# Altium project dianfazhan.PRJPCB
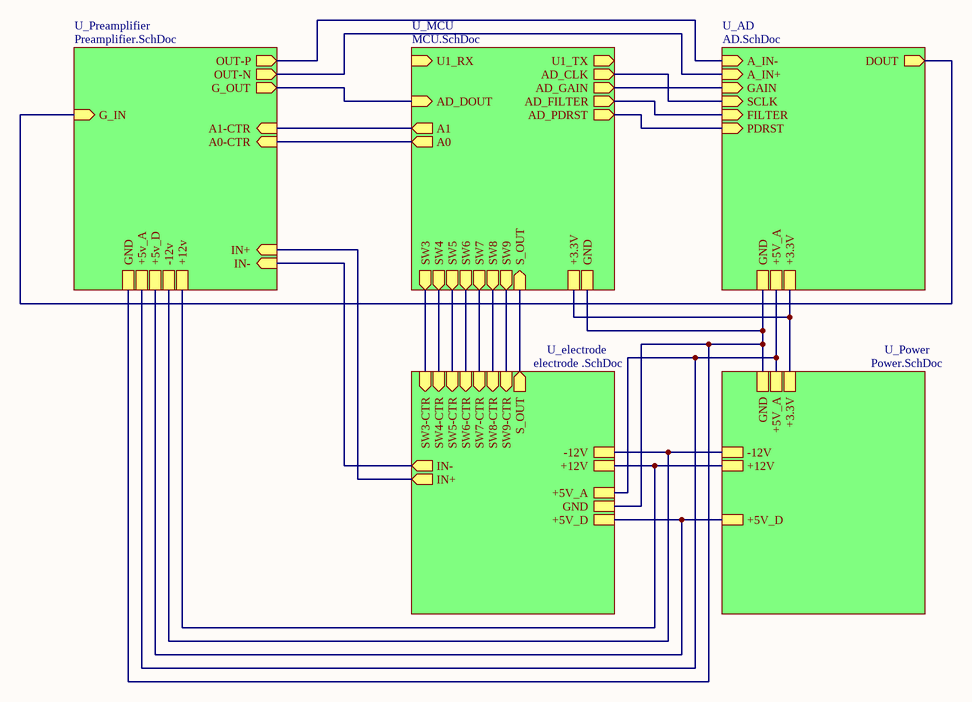
[diagram p0: main.SchDoc]
7 sheets, 227 parts. Net scope: hierarchical (ports join the sheet entries above them; power ports are global).
Sheets:
  main.SchDoc
    U_MCU = MCU.SchDoc
    U_AD = AD.SchDoc
    U_Power = Power.SchDoc
  GPS.SchDoc
  Preamplifier_2.SchDoc
  electrode 2.SchDoc

## Sheet main.SchDoc
size A4

### Sub-sheets
U_AD = AD.SchDoc: A_IN- (in), A_IN+ (in), PDRST (in), FILTER (in), SCLK (in), DOUT (out), GAIN (in), +3.3V, +5V_A, GND
U_electrode = electrode .SchDoc (file not in this document): SW3-CTR (in), SW4-CTR (in), SW5-CTR (in), SW6-CTR (in), SW7-CTR (in), SW8-CTR (in), SW9-CTR (in), IN+ (out), IN- (out), +12V, GND, +5V_A, S_OUT (out), -12V, +5V_D
U_MCU = MCU.SchDoc: U1_RX (in), U1_TX (out), +3.3V, GND, AD_CLK (out), AD_DOUT (in), AD_GAIN (out), AD_FILTER (out), AD_PDRST (out), S_OUT (in), SW3 (out), SW4 (out), SW5 (out), SW6 (out), SW7 (out), SW8 (out), SW9 (out), A1 (out), A0 (out)
U_Power = Power.SchDoc: +12V, -12V, +5V_A, +3.3V, GND, +5V_D
U_Preamplifier = Preamplifier.SchDoc (file not in this document): IN+ (in), IN- (in), A0-CTR (in), A1-CTR (in), OUT-P (out), OUT-N (out), G_IN (in), G_OUT (out), +12v, -12v, +5v_D, GND, +5v_A

### Nets
+3.3V: sheet U_MCU/+3.3V, sheet U_AD/+3.3V, sheet U_Power/+3.3V
+5V_A: sheet U_AD/+5V_A, sheet U_Power/+5V_A, sheet U_Preamplifier/+5v_A, sheet U_electrode/+5V_A
+5V_D: sheet U_Power/+5V_D, sheet U_Preamplifier/+5v_D, sheet U_electrode/+5V_D
+12V: sheet U_Power/+12V, sheet U_Preamplifier/+12v, sheet U_electrode/+12V
-12V: sheet U_Power/-12V, sheet U_Preamplifier/-12v, sheet U_electrode/-12V
A_IN+: sheet U_AD/A_IN+, sheet U_Preamplifier/OUT-N
A_IN-: sheet U_AD/A_IN-, sheet U_Preamplifier/OUT-P
DOUT: sheet U_AD/DOUT, sheet U_Preamplifier/G_IN
FILTER: sheet U_MCU/AD_FILTER, sheet U_AD/FILTER
GAIN: sheet U_MCU/AD_GAIN, sheet U_AD/GAIN
PDRST: sheet U_MCU/AD_PDRST, sheet U_AD/PDRST
SCLK: sheet U_MCU/AD_CLK, sheet U_AD/SCLK
NetR26_2: sheet U_MCU/GND, sheet U_AD/GND, sheet U_Power/GND, sheet U_Preamplifier/GND, sheet U_electrode/GND
NetU36_8: sheet U_MCU/S_OUT, sheet U_electrode/S_OUT
NetU36_9: sheet U_MCU/SW3, sheet U_electrode/SW3-CTR
NetU36_10: sheet U_MCU/SW4, sheet U_electrode/SW4-CTR
NetU36_11: sheet U_MCU/SW5, sheet U_electrode/SW5-CTR
NetU36_14: sheet U_MCU/SW6, sheet U_electrode/SW6-CTR
NetU36_15: sheet U_MCU/SW7, sheet U_electrode/SW7-CTR
NetU36_16: sheet U_MCU/SW8, sheet U_electrode/SW8-CTR
NetU36_17: sheet U_MCU/SW9, sheet U_electrode/SW9-CTR
NetU36_22: sheet U_MCU/AD_DOUT, sheet U_Preamplifier/G_OUT
NetU36_58: sheet U_MCU/A1, sheet U_Preamplifier/A1-CTR
NetU36_59: sheet U_MCU/A0, sheet U_Preamplifier/A0-CTR
(unnamed): sheet U_Preamplifier/IN+, sheet U_electrode/IN+
(unnamed): sheet U_Preamplifier/IN-, sheet U_electrode/IN-

## Sheet MCU.SchDoc
size A4
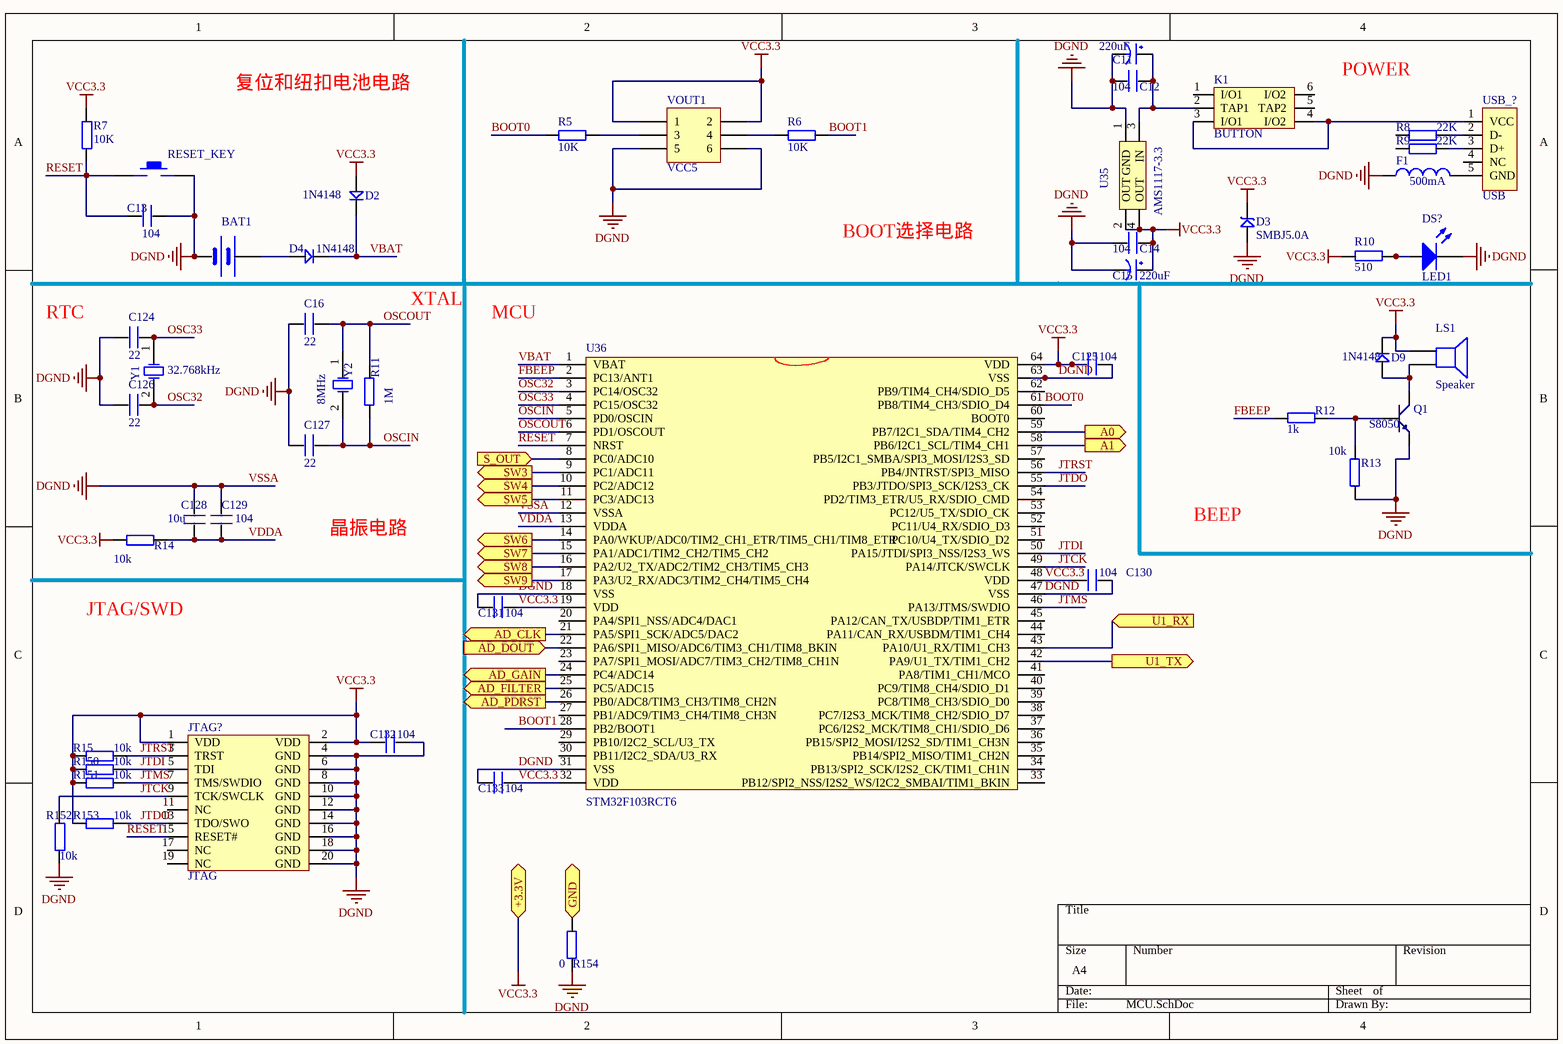
[diagram p1: MCU.SchDoc]

### Parts
BAT1  BATT  [BATM]  (value not drawn)
C11  220uF  [CC6.56.5]
C12  104  [0603P]
C13  104  [0603P]
C14  104  [0603P]
C15  220uF  [CC6.56.5]
C16  22  [0603P]
C124  22  [0603P]
C125  104  [0603P]
C126  22  [0603P]
C127  22  [0603P]
C128  10u  [0603P]
C129  104  [0603P]
C130  104  [0603P]
C131  104  [0603P]
C132  104  [0603P]
C133  104  [0603P]
D2  1N4148  [DIODE_SOP]
D3  SMBJ5.0A  [SMBJ]
D4  1N4148  [DIODE_SOP]
D9  1N4148  [DIODE_SOP]
DS?  LED1  [SMDLED]
F1  value 500mA  [0402-A]  (hidden comment: Inductor)
JTAG?  JTAG  [JTAG_20]
K1  BUTTON  [BTN8.5*8.5]
LS1  Speaker  [PIN2]
Q1  S8050  [SOT-23R]
R5  10K  [0603P]
R6  10K  [0603P]
R7  10K  [0603P]
R8  22K  [0603P]
R9  22K  [0603P]
R10  510  [0603P]
R11  1M  [0603P]
R12  1k  [0603P]
R13  10k  [0603P]
R14  10k  [0603P]
R15  10k  [0603P]
R150  10k  [0603P]
R151  10k  [0603P]
R152  10k  [0603P]
R153  10k  [0603P]
R154  0  [0603P]
RESET_KEY  KEY_M  [KEY_M]  (value not drawn)
U35  AMS1117-3.3  [AMS1117]
U36  STM32F103RCT6  [LQFP64]
USB_?  USB  [USB/SM0.8-6H5]
VOUT1  VCC5  [HDR2X3]
Y1  32.768kHz  [XTAL_US]
Y2  8MHz  [XTAL_US]

### Ports
+3.3V, A0 (out), A1 (out), AD_CLK (out), AD_DOUT (in), AD_FILTER (out), AD_GAIN (out), AD_PDRST (out), GND, S_OUT (in), SW3 (out), SW4 (out), SW5 (out), SW6 (out), SW7 (out), SW8 (out), SW9 (out), U1_RX (in), U1_TX (out)

### Nets
DGND: BAT1.2(GND) C11.2(GND) C12.2 C13.2 C14.2 C15.2(GND) C16.1 C124.1 C125.2 C126.1 C127.2 C128.2 C129.2 C130.2 C131.1 C132.2 C133.1 D3.1 DS?.2(K) F1.1 JTAG?.4(GND) JTAG?.6(GND) JTAG?.8(GND) JTAG?.10(GND) JTAG?.12(GND) JTAG?.14(GND) JTAG?.16(GND) JTAG?.18(GND) JTAG?.20(GND) Q1.1(E) R13.2 R152.1 R154.2 RESET_KEY.2 U35.1(GND) U36.12(VSSA) U36.18(VSS) U36.31(VSS) U36.47(VSS) U36.63(VSS) VOUT1.5 VOUT1.6  [also labelled VSSA]
VCC3.3: C14.1 C15.1(VCC) C125.1 C130.1 C131.2 C132.1 C133.2 D2.1 D3.2 D9.2 JTAG?.1(VDD) JTAG?.2(VDD) LS1.1 R7.2 R10.2 R14.1 R15.1 R150.1 R151.1 R153.1 U35.2(OUT) U35.4(OUT) U36.19(VDD) U36.32(VDD) U36.48(VDD) U36.64(VDD) VOUT1.1 VOUT1.2 ; port +3.3V  [project net +3.3V]
BOOT0: R5.1 U36.61(PB8/TIM4_CH3/SDIO_D4)
BOOT1: R6.2 U36.28(PB2/BOOT1)
FBEEP: R12.2 U36.2(PC13/ANT1)
FILTER: U36.25(PC5/ADC15) ; port AD_FILTER
GAIN: U36.24(PC4/ADC14) ; port AD_GAIN
JTCK: JTAG?.9(TCK/SWCLK) R152.2 U36.49(PA14/JTCK/SWCLK)
JTDI: JTAG?.5(TDI) R150.2 U36.50(PA15/JTDI/SPI3_NSS/I2S3_WS)
JTDO: JTAG?.13(TDO/SWO) R153.2 U36.55(PB3/JTDO/SPI3_SCK/I2S3_CK)
JTMS: JTAG?.7(TMS/SWDIO) R151.2 U36.46(PA13/JTMS/SWDIO)
JTRST: JTAG?.3(TRST) R15.2 U36.56(PB4/JNTRST/SPI3_MISO)
OSC32: C126.2 U36.3(PC14/OSC32) Y1.2(OSC2)
OSC33: C124.2 U36.4(PC15/OSC32) Y1.1(OSC1)
OSCIN: C127.1 R11.2 U36.5(PD0/OSCIN) Y2.2(OSC2)
OSCOUT: C16.2 R11.1 U36.6(PD1/OSCOUT) Y2.1(OSC1)
PDRST: U36.26(PB0/ADC8/TIM3_CH3/TIM8_CH2N) ; port AD_PDRST
RESET: C13.1 JTAG?.15(RESET#) R7.1 RESET_KEY.1 U36.7(NRST)
SCLK: U36.21(PA5/SPI1_SCK/ADC5/DAC2) ; port AD_CLK
VBAT: D2.2 D4.2 U36.1(VBAT)
VDDA: C128.1 C129.1 R14.2 U36.13(VDDA)
NetBAT1_1: BAT1.1(VCC) D4.1
NetC11_1: C11.1(VCC) C12.1 K1.2(TAP1) U35.3(IN)
NetD9_1: D9.1 LS1.2 Q1.3(C)
NetDS?_1: DS?.1(A) R10.1
NetF1_2: F1.2 USB_?.5(GND)
NetK1_3: K1.3(I/O1) K1.4(I/O2) USB_?.1(VCC)
NetQ1_2: Q1.2(B) R12.1 R13.1
NetR5_2: R5.2 VOUT1.3
NetR6_1: R6.1 VOUT1.4
NetR8_2: R8.2 USB_?.2(D-)
NetR9_2: R9.2 USB_?.3(D+)
NetR26_2: R154.1 ; port GND
NetU36_8: U36.8(PC0/ADC10) ; port S_OUT
NetU36_9: U36.9(PC1/ADC11) ; port SW3
NetU36_10: U36.10(PC2/ADC12) ; port SW4
NetU36_11: U36.11(PC3/ADC13) ; port SW5
NetU36_14: U36.14(PA0/WKUP/ADC0/TIM2_CH1_ETR/TIM5_CH1/TIM8_ETR) ; port SW6
NetU36_15: U36.15(PA1/ADC1/TIM2_CH2/TIM5_CH2) ; port SW7
NetU36_16: U36.16(PA2/U2_TX/ADC2/TIM2_CH3/TIM5_CH3) ; port SW8
NetU36_17: U36.17(PA3/U2_RX/ADC3/TIM2_CH4/TIM5_CH4) ; port SW9
NetU36_22: U36.22(PA6/SPI1_MISO/ADC6/TIM3_CH1/TIM8_BKIN) ; port AD_DOUT
NetU36_42: U36.42(PA9/U1_TX/TIM1_CH2) ; port U1_TX
NetU36_43: U36.43(PA10/U1_RX/TIM1_CH3) ; port U1_RX
NetU36_58: U36.58(PB6/I2C1_SCL/TIM4_CH1) ; port A1
NetU36_59: U36.59(PB7/I2C1_SDA/TIM4_CH2) ; port A0

Not connected (* = marked no-connect by the designer): JTAG? 11(NC) 17(NC) 19(NC); K1 1(I/O1) 5(TAP2) 6(I/O2); R8 1; R9 1; U36 20(PA4/SPI1_NSS/ADC4/DAC1) 23(PA7/SPI1_MOSI/ADC7/TIM3_CH2/TIM8_CH1N) 27(PB1/ADC9/TIM3_CH4/TIM8_CH3N) 29(PB10/I2C2_SCL/U3_TX) 30(PB11/I2C2_SDA/U3_RX) 33(PB12/SPI2_NSS/I2S2_WS/I2C2_SMBAI/TIM1_BKIN) 34(PB13/SPI2_SCK/I2S2_CK/TIM1_CH1N) 35(PB14/SPI2_MISO/TIM1_CH2N) 36(PB15/SPI2_MOSI/I2S2_SD/TIM1_CH3N) 37(PC6/I2S2_MCK/TIM8_CH1/SDIO_D6) 38(PC7/I2S3_MCK/TIM8_CH2/SDIO_D7) 39(PC8/TIM8_CH3/SDIO_D0) 40(PC9/TIM8_CH4/SDIO_D1) 41(PA8/TIM1_CH1/MCO) 44(PA11/CAN_RX/USBDM/TIM1_CH4) 45(PA12/CAN_TX/USBDP/TIM1_ETR) 51(PC10/U4_TX/SDIO_D2) 52(PC11/U4_RX/SDIO_D3) 53(PC12/U5_TX/SDIO_CK) 54(PD2/TIM3_ETR/U5_RX/SDIO_CMD) 57(PB5/I2C1_SMBA/SPI3_MOSI/I2S3_SD) 60(BOOT0) 62(PB9/TIM4_CH4/SDIO_D5); USB_? 4(NC)

### Notes on the sheet
- 复位和纽扣电池电路
- POWER
- BOOT选择电路
- RTC
- XTAL
- MCU
- BEEP
- 晶振电路
- JTAG/SWD

### Library data of the parts
BAT1 = BAT
C11 C15 = CAP
C12-C14 C16 C124-C133 = C
D2 D4 D9 = D
D3 = SMBJ: TVS
DS? = LED2: Typical RED, GREEN, YELLOW, AMBER GaAs LED; Published: 8-Jun-2000; LatestRevisionDate: 17-Jul-2002; LatestRevisionNote: Re-released for DXP Platform.; PackageDocument: Feb-2002; PackageReference: 3.2X1.6X1.1; Publisher: Altium Limited
F1 = Inductor: Code_IEC: 1005; Published: 8-Jun-2000; LatestRevisionDate: 17-Jul-2002; LatestRevisionNote: Re-released for DXP Platform.; PackageReference: 0402-A; Publisher: Altium Limited; Code_JEITA: 0402
LS1 = Speaker: Loudspeaker; Published: 24-Mar-1999; LatestRevisionDate: 17-Jul-2002; LatestRevisionNote: Re-released for DXP Platform.; PackageReference: PIN2; Publisher: Altium Limited
Q1 = NPN: 8050/BCW846/BCW847
R5-R15 R150-R154 = R
U35 = AMS1117
U36 = STM32F103RDT6
USB_? = USB5
VOUT1 = Header 3X2: Header, 3-Pin, Dual row; LatestRevisionDate: 17-Jul-2002; LatestRevisionNote: Re-released for DXP Platform.; Publisher: Altium Limited
Y1 Y2 = XTAL: Crystal Oscillator; Published: 8-Jun-2000; LatestRevisionDate: 17-Jul-2002; LatestRevisionNote: Re-released for DXP Platform.; Publisher: Altium Limited

## Sheet AD.SchDoc
size 203 x 152 mm
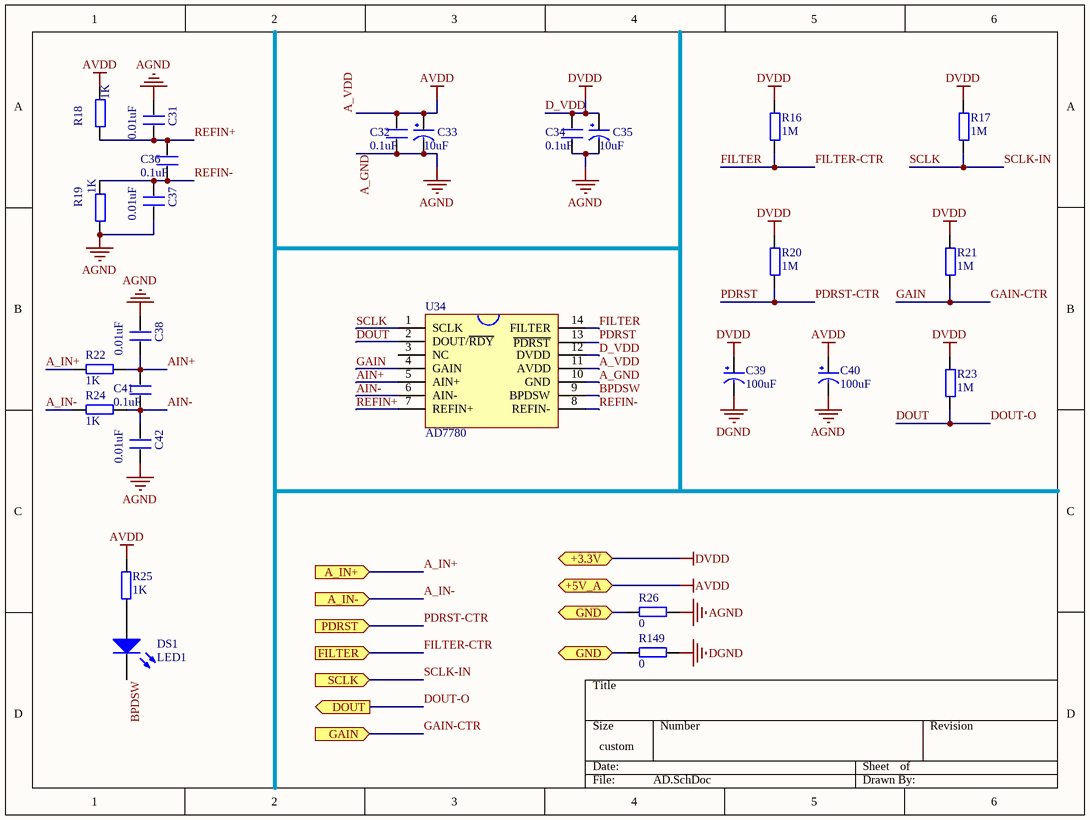
[diagram p2: AD.SchDoc]

### Parts
C31  0.01uF  [0603P]
C32  0.1uF  [0603P]
C33  10uF  [CC6.56.5]
C34  0.1uF  [0603P]
C35  10uF  [CC6.56.5]
C36  0.1uF  [0603P]
C37  0.01uF  [0603P]
C38  0.01uF  [0603P]
C39  100uF  [CC6.56.5]
C40  100uF  [CC6.56.5]
C41  0.1uF  [0603P]
C42  0.01uF  [0603P]
DS1  LED1  [SMDLED]
R16  1M  [0603P]
R17  1M  [0603P]
R18  1K  [0603P]
R19  1K  [0603P]
R20  1M  [0603P]
R21  1M  [0603P]
R22  1K  [0603P]
R23  1M  [0603P]
R24  1K  [0603P]
R25  1K  [0603P]
R26  0  [0603P]
R149  0  [0603P]
U34  AD7780  [SOIC_14]

### Ports
+3.3V, +5V_A, A_IN+ (in), A_IN- (in), DOUT (out), FILTER (in), GAIN (in), GND, PDRST (in), SCLK (in)

### Nets
A_GND: C31.2 C32.1 C33.2(GND) C34.1 C35.2(GND) C37.1 C38.2 C40.2(GND) C42.1 R19.1 R26.1 U34.10(GND)  [also labelled AGND]
A_VDD: C32.2 C33.1(VCC) C40.1(VCC) R18.2 R25.1 U34.11(AVDD) ; port +5V_A  [also labelled AVDD]  [project net +5V_A]
D_VDD: C34.2 C35.1(VCC) C39.1(VCC) R16.2 R17.2 R20.2 R21.2 R23.2 U34.12(DVDD) ; port +3.3V  [also labelled DVDD]  [project net +3.3V]
DGND: C39.2(GND) R149.1
A_IN+: R22.2 ; port A_IN+
A_IN-: R24.2 ; port A_IN-
AIN+: C38.1 C41.2 R22.1 U34.5(AIN+)
AIN-: C41.1 C42.2 R24.1 U34.6(AIN-)
BPDSW: DS1.2(K) U34.9(BPDSW)
DOUT: R23.1 U34.2(DOUT/~{RDY}) ; port DOUT  [also labelled DOUT-O]
FILTER: R16.1 U34.14(FILTER) ; port FILTER  [also labelled FILTER-CTR]
GAIN: R21.1 U34.4(GAIN) ; port GAIN  [also labelled GAIN-CTR]
PDRST: R20.1 U34.13(~{PDRST}) ; port PDRST  [also labelled PDRST-CTR]
REFIN+: C31.1 C36.2 R18.1 U34.7(REFIN+)
REFIN-: C36.1 C37.2 R19.2 U34.8(REFIN-)
SCLK: R17.1 U34.1(SCLK) ; port SCLK  [also labelled SCLK-IN]
NetDS1_1: DS1.1(A) R25.2
NetR26_2: R26.2 R149.2 ; port GND

Not connected (* = marked no-connect by the designer): U34 3(NC)

### Library data of the parts
C31 C32 C34 C36-C38 C41 C42 = C
C33 C35 C39 C40 = CAP
DS1 = LED2: as DS? on sheet MCU; Published: 8-Jun-2000; LatestRevisionDate: 17-Jul-2002; LatestRevisionNote: Re-released for DXP Platform.; PackageDocument: Feb-2002; PackageReference: 3.2X1.6X1.1; Publisher: Altium Limited
R16-R26 R149 = R

## Sheet Power.SchDoc
size 241 x 215 mm
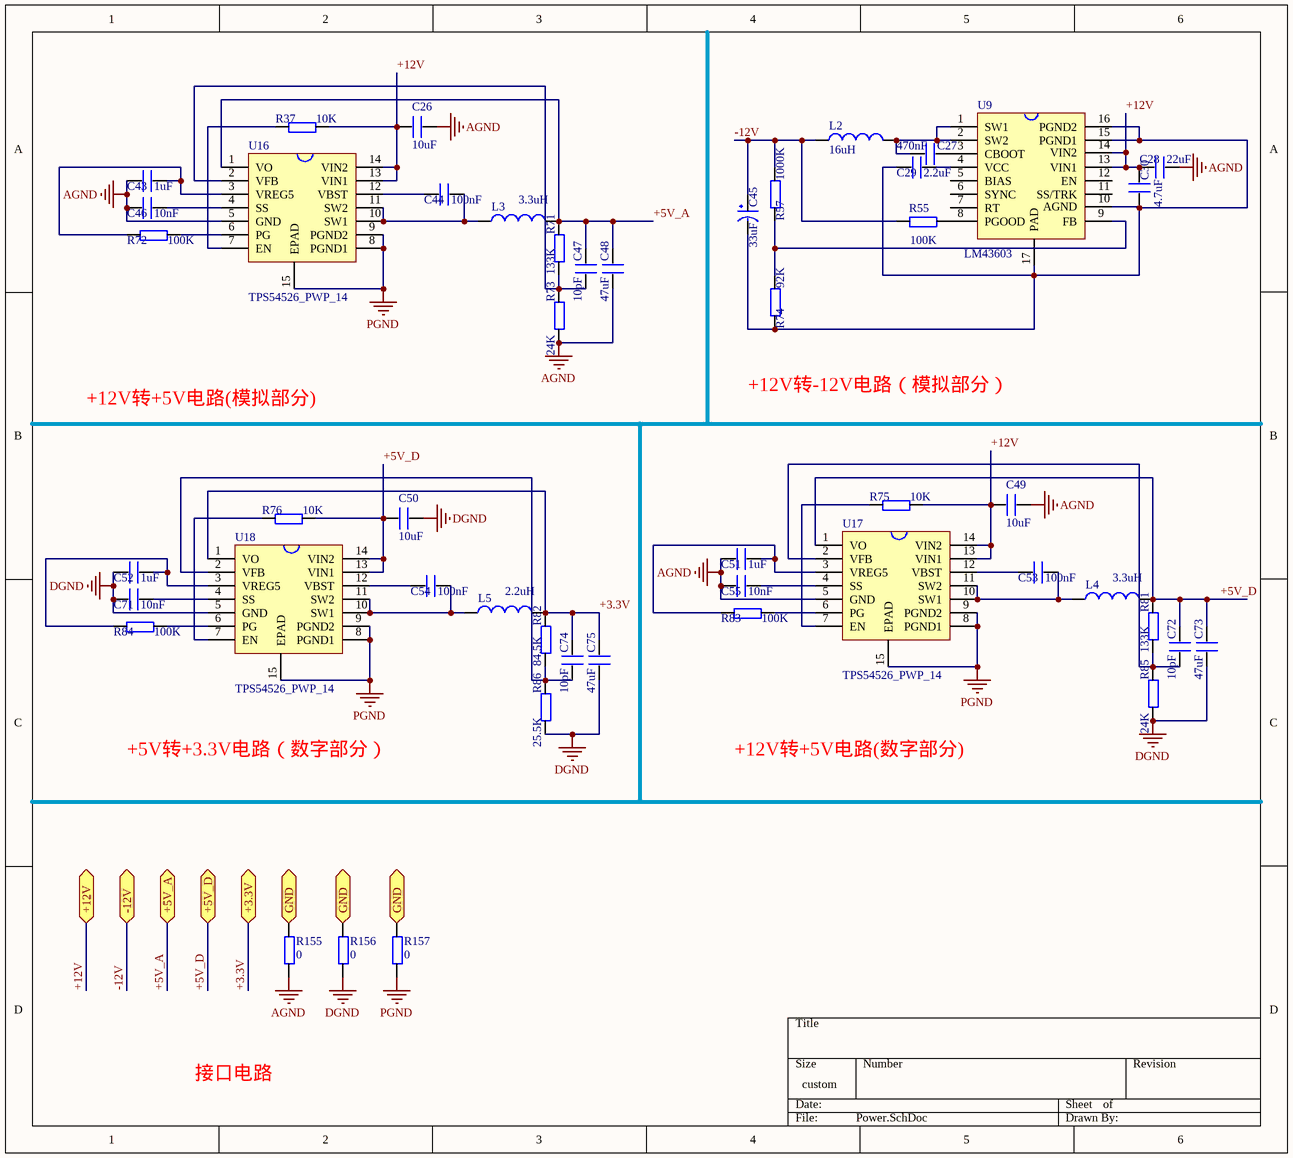
[diagram p3: Power.SchDoc]

### Parts
C26  10uF  [0603P]
C27  470nF  [0603P]
C28  22uF  [0603P]
C29  2.2uF  [0603P]
C30  4.7uF  [0603P]
C43  1uF  [0603P]
C44  100nF  [0603P]
C45  33uF  [CC6.56.5]
C46  10nF  [0603P]
C47  10pF  [0603P]
C48  47uF  [0603P]
C49  10uF  [0603P]
C50  10uF  [0603P]
C51  1uF  [0603P]
C52  1uF  [0603P]
C53  100nF  [0603P]
C54  100nF  [0603P]
C55  10nF  [0603P]
C71  10nF  [0603P]
C72  10pF  [0603P]
C73  47uF  [0603P]
C74  10pF  [0603P]
C75  47uF  [0603P]
L2  value 16uH  [0402-A]  (hidden comment: Inductor)
L3  value 3.3uH  [0402-A]  (hidden comment: Inductor)
L4  value 3.3uH  [0402-A]  (hidden comment: Inductor)
L5  value 2.2uH  [0402-A]  (hidden comment: Inductor)
R37  10K  [0603P]
R55  100K  [0603P]
R57  1000K  [0603P]
R71  133K  [0603P]
R72  100K  [0603P]
R73  24K  [0603P]
R74  92K  [0603P]
R75  10K  [0603P]
R76  10K  [0603P]
R81  133K  [0603P]
R82  84.5K  [0603P]
R83  100K  [0603P]
R84  100K  [0603P]
R85  24K  [0603P]
R86  25.5K  [0603P]
R155  0  [0603P]
R156  0  [0603P]
R157  0  [0603P]
U9  LM43603
U16  TPS54526_PWP_14  [HTSSOP]
U17  TPS54526_PWP_14  [HTSSOP]
U18  TPS54526_PWP_14  [HTSSOP]

### Ports
+3.3V, +5V_A, +5V_D, +12V, -12V, GND

### Nets
+3.3V: C74.2 C75.2 L5.2 R82.2 U18.1(VO) ; port +3.3V
+5V_A: C47.2 C48.2 L3.2 R71.2 U16.1(VO) ; port +5V_A
AGND: C26.2 C28.2 C43.1 C46.1 C48.1 C49.2 C51.1 C55.1 R73.1 R155.1 U16.5(GND) U17.5(GND)  [project net A_GND]
DGND: C50.2 C52.1 C71.1 C73.1 C75.1 R85.1 R86.1 R156.1 U18.5(GND)
PGND: R157.1 U16.8(PGND1) U16.9(PGND2) U16.15(EPAD) U17.8(PGND1) U17.9(PGND2) U17.15(EPAD) U18.8(PGND1) U18.9(PGND2) U18.15(EPAD)
+5V_D: C50.1 C72.2 C73.2 L4.2 R76.2 R81.2 U17.1(VO) U18.13(VIN1) U18.14(VIN2) ; port +5V_D
+12V: C26.1 C28.1 C30.2 C49.1 R37.2 R75.2 U9.13(VIN1) U9.14(VIN2) U16.13(VIN1) U16.14(VIN2) U17.13(VIN1) U17.14(VIN2) ; port +12V
-12V: C45.1(VCC) L2.1 R55.1 R57.2 ; port -12V
NetC27_1: C27.1 L2.2 U9.1(SW1) U9.2(SW2)
NetC27_2: C27.2 U9.3(CBOOT)
NetC29_1: C29.1 C30.1 C45.2(GND) R74.1 U9.10(AGND) U9.15(PGND1) U9.16(PGND2) U9.17(PAD)
NetC29_2: C29.2 U9.4(VCC)
NetC43_2: C43.2 R72.1 U16.3(VREG5)
NetC44_1: C44.1 U16.12(VBST)
NetC44_2: C44.2 L3.1 U16.10(SW1) U16.11(SW2)
NetC46_2: C46.2 U16.4(SS)
NetC47_1: C47.1 R71.1 R73.2 U16.2(VFB)
NetC51_2: C51.2 R83.1 U17.3(VREG5)
NetC52_2: C52.2 R84.1 U18.3(VREG5)
NetC53_1: C53.1 U17.12(VBST)
NetC53_2: C53.2 L4.1 U17.10(SW1) U17.11(SW2)
NetC54_1: C54.1 U18.12(VBST)
NetC54_2: C54.2 L5.1 U18.10(SW1) U18.11(SW2)
NetC55_2: C55.2 U17.4(SS)
NetC71_2: C71.2 U18.4(SS)
NetC72_1: C72.1 R81.1 R85.2 U17.2(VFB)
NetC74_1: C74.1 R82.1 R86.2 U18.2(VFB)
NetR26_2: R155.2 R156.2 R157.2 ; port GND
NetR37_1: R37.1 U16.7(EN)
NetR55_2: R55.2 U9.8(PGOOD)
NetR57_1: R57.1 R74.2 U9.9(FB)
NetR72_2: R72.2 U16.6(PG)
NetR75_1: R75.1 U17.7(EN)
NetR76_1: R76.1 U18.7(EN)
NetR83_2: R83.2 U17.6(PG)
NetR84_2: R84.2 U18.6(PG)

Not connected (* = marked no-connect by the designer): U9 5(BIAS) 6(SYNC) 7(RT) 11(SS/TRK) 12(EN)

### Notes on the sheet
- +12V转+5V电路(模拟部分)
- +12V转-12V电路（模拟部分）
- +5V转+3.3V电路（数字部分）
- +12V转+5V电路(数字部分)
- 接口电路

### Library data of the parts
C26-C30 C43 C44 C46-C55 C71-C75 = C
C45 = CAP
L2-L5 = Inductor: Code_IEC: 1005; Published: 8-Jun-2000; LatestRevisionDate: 29-May-2009; LatestRevisionNote: IPC-7351 Footprint Added.; PackageReference: 0402-A; Publisher: Altium Limited; PackageDescription: Chip Inductor; Code_JEITA: 0402
R37 R55 R57 R71-R76 R81-R86 R155-R157 = R
U16-U18 = TPS54526

## Sheet GPS.SchDoc
size A4
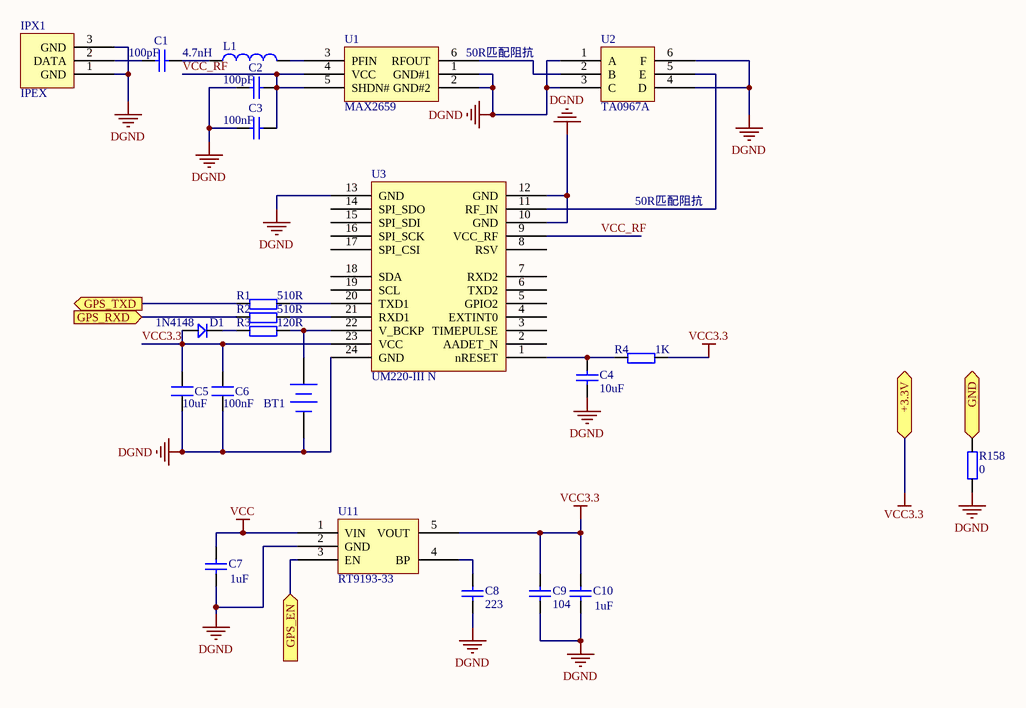
[diagram p4: GPS.SchDoc]

### Parts
BT1  Battery  [BAT]  (value not drawn)
C1  value 100pF  [0805]  (hidden comment: Cap)
C2  value 100pF  [0805]  (hidden comment: Cap)
C3  value 100nF  [0805]  (hidden comment: Cap)
C4  value 10uF  [0805]  (hidden comment: Cap)
C5  10uF  [0805]
C6  100nF  [0805]
C7  value 1uF  [0805]  (hidden comment: Cap)
C8  value 223  [0805]  (hidden comment: Cap)
C9  value 104  [0805]  (hidden comment: Cap)
C10  value 1uF  [0805]  (hidden comment: Cap)
D1  1N4148  [LC-SOD-323]
IPX1  IPEX  [IPEX]
L1  value 4.7nH  [0805]  (hidden comment: Inductor)
R1  510R  [0805]
R2  510R  [0805]
R3  120R  [0805]
R4  1K  [0805]
R158  0  [0805]
U1  MAX2659  [LC-uDFN-6]
U2  TA0967A  [TA0967A]
U3  UM220-III N  [UM220-III N]
U11  RT9193-33  [RT9193-33]

### Ports
+3.3V, GND, GPS_EN (in), GPS_RXD (in), GPS_TXD (out)

### Nets
DGND: BT1.2(-) C2.1 C3.1 C4.1 C5.1 C6.1 C7.1 C8.1 C9.1 C10.1 IPX1.1(GND) IPX1.3(GND) R158.1 U1.1(GND#1) U1.2(GND#2) U2.1(A) U2.3(C) U2.4(D) U2.6(F) U3.10(GND) U3.12(GND) U3.13(GND) U3.24(GND) U11.2(GND)
VCC: C7.2 U11.1(VIN)
VCC3.3: C5.2 C6.2 C9.2 C10.2 D1.1 R4.2 U3.23(VCC) U11.5(VOUT) ; port +3.3V  [project net +3.3V]
VCC_RF: C2.2 C3.2 U1.4(VCC) U1.5(SHDN#) U3.9(VCC_RF)
NetBT1_1: BT1.1(+) R3.2 U3.22(V_BCKP)
NetC1_1: C1.1 IPX1.2(DATA)
NetC1_2: C1.2 L1.1
NetC4_2: C4.2 R4.1 U3.1(nRESET)
NetC8_2: C8.2 U11.4(BP)
NetD1_2: D1.2 R3.1
NetL1_2: L1.2 U1.3(PFIN)
NetR1_1: R1.1 ; port GPS_TXD
NetR1_2: R1.2 U3.20(TXD1)
NetR2_1: R2.1 ; port GPS_RXD
NetR2_2: R2.2 U3.21(RXD1)
NetR158_2: R158.2 ; port GND
NetU1_6: U1.6(RFOUT) U2.2(B)
NetU2_5: U2.5(E) U3.11(RF_IN)
NetU11_3: U11.3(EN) ; port GPS_EN

Not connected (* = marked no-connect by the designer): U3 2(AADET_N) 3(TIMEPULSE) 4(EXTINT0) 5(GPIO2) 6(TXD2) 7(RXD2) 8(RSV) 14(SPI_SDO) 15(SPI_SDI) 16(SPI_SCK) 17(SPI_CSI) 18(SDA) 19(SCL)

### Notes on the sheet
- (near U1) 50R匹配阻抗
- 50R匹配阻抗

### Library data of the parts
BT1 = Battery: Multicell Battery; Published: 24-Mar-1999; LatestRevisionDate: 17-Jul-2002; LatestRevisionNote: Re-released for DXP Platform.; PackageReference: BAT-2; Publisher: Altium Limited; PackageDescription: Battery; 2 Leads
C1-C4 C7-C10 = Cap: Capacitor; Published: 8-Jun-2000; LatestRevisionDate: 17-Jul-2002; LatestRevisionNote: Re-released for DXP Platform.; PackageReference: RAD-0.3; Publisher: Altium Limited; PackageDescription: Radial Cap, Thru-Hole; 2 Leads; 0.3 in Pin Spacing
C5 C6 = C
D1 = D
IPX1 = IPX
L1 = Inductor: Code_IEC: 1005; Published: 8-Jun-2000; LatestRevisionDate: 29-May-2009; LatestRevisionNote: IPC-7351 Footprint Added.; PackageReference: 0402-A; Publisher: Altium Limited; PackageDescription: Chip Inductor; Code_JEITA: 0402
R1-R4 R158 = R
U3 = Component_1

## Sheet Preamplifier_2.SchDoc
size A4
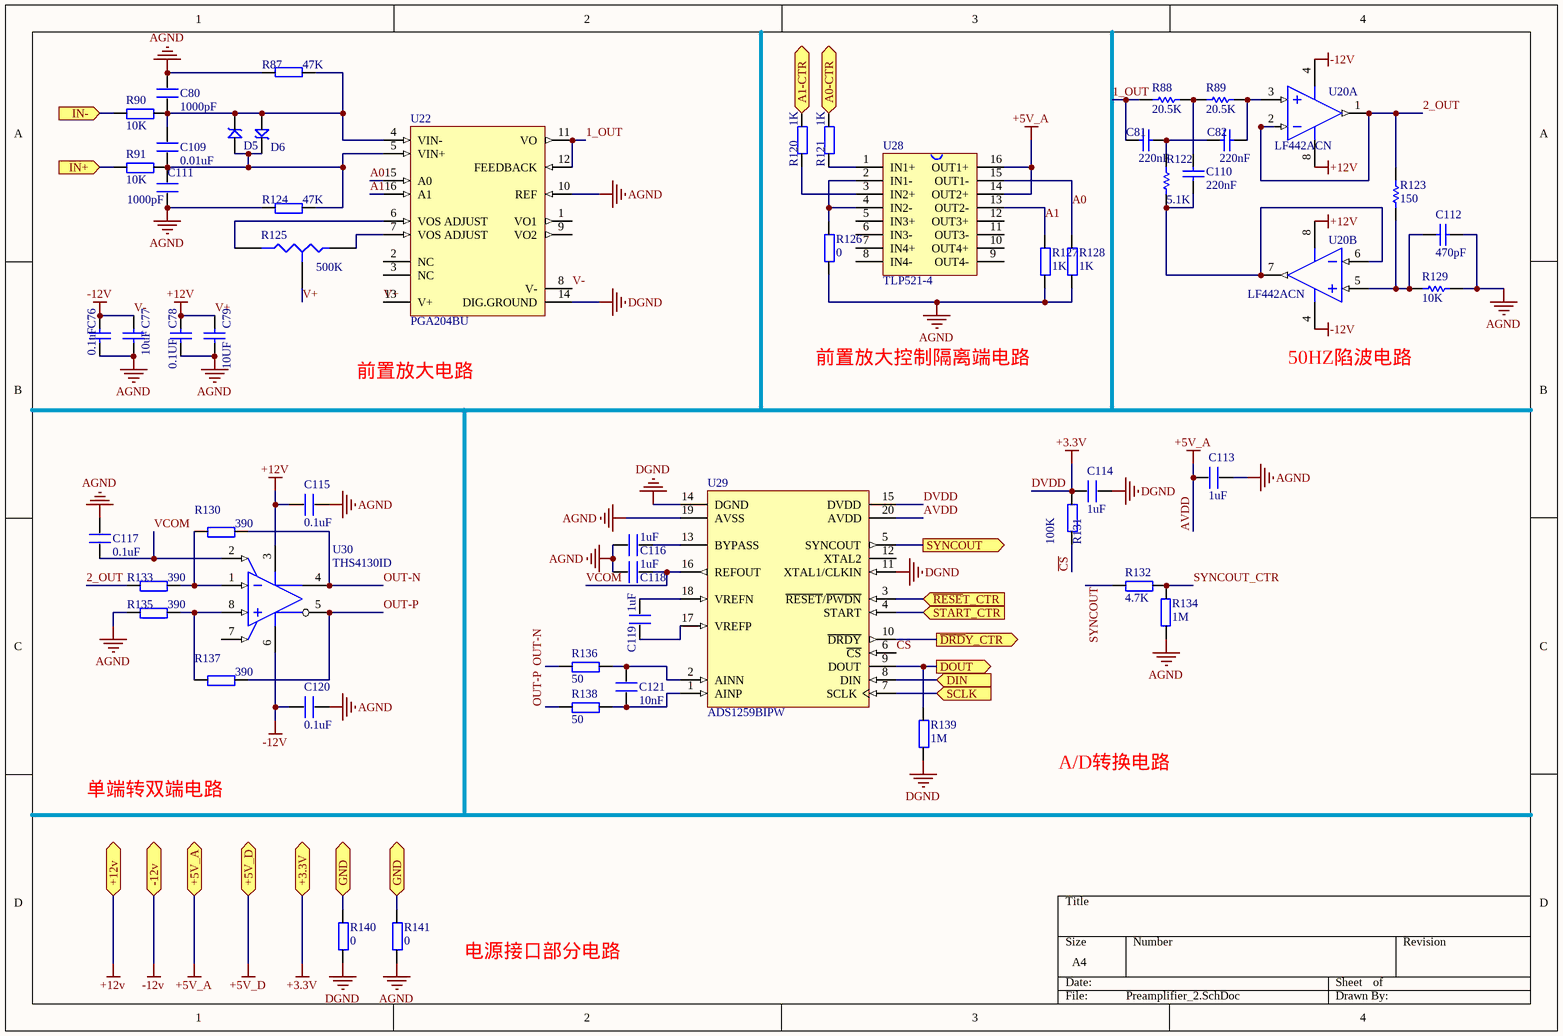
[diagram p5: Preamplifier_2.SchDoc]

### Parts
C76  0.1uF  [0805]
C77  10uF  [0805]
C78  0.1UF  [0805]
C79  10UF  [0805]
C80  1000pF  [0603P]
C81  220nF  [C0805]
C82  220nF  [C0805]
C109  0.01uF  [0603P]
C110  220nF  [C0805]
C111  1000pF  [0603P]
C112  470pF  [C0805]
C113  1uF  [0603P]
C114  1uF  [0603P]
C115  0.1uF  [0603P]
C116  1uF  [0603P]
C117  0.1uF  [0603P]
C118  1uF  [0603P]
C119  1uF  [0603P]
C120  0.1uF  [0603P]
C121  10nF  [0603P]
D5  SMBJ5.0A  [SMBJ]  (value not drawn)
D6  SMBJ5.0A  [SMBJ]  (value not drawn)
R87  47K  [0603P]
R88  20.5K  [R0805]
R89  20.5K  [R0805]
R90  10K  [0603P]
R91  10K  [0603P]
R120  1K  [0603P]
R121  1K  [0603P]
R122  5.1K  [R0805]
R123  150  [R0805]
R124  47K  [0603P]
R125  value 500K  [VR3]  (hidden comment: Res Tap)
R126  0  [0603P]
R127  1K  [0603P]
R128  1K  [0603P]
R129  10K  [R0805]
R130  390  [0603P]
R131  100K  [0603P]
R132  4.7K  [0603P]
R133  390  [0603P]
R134  1M  [0603P]
R135  390  [0603P]
R136  50  [0603P]
R137  390  [0603P]
R138  50  [0603P]
R139  1M  [0603P]
R140  0  [0603P]
R141  0  [0603P]
U20  LF442ACN  [N08E]  (parts A,B of 2)
U22  PGA204BU  [TI-DW16_N]
U28  TLP521-4  [11-20A3]
U29  ADS1259BIPW  [TI-PW20_N]
U30  THS4130ID  [TI-D8_N]

### Ports
+3.3V, +5V_A, +5V_D, +12v, -12v, A0-CTR (in), A1-CTR (in), DIN (in), DOUT (out), GND, IN+ (in), IN- (in), SCLK (in), START_CTR (in), SYNCOUT (out), ~{DRD}Y_CTR (out), ~{RESE}T_CTR (in)

### Nets
+5V_D: port +5V_D
AGND: C76.1 C77.1 C78.1 C79.1 C80.2 C111.1 C112.1 C113.1 C115.1 C116.1 C117.1 C118.1 C120.1 R87.2 R124.1 R126.1 R127.1 R128.1 R129.1 R134.2 R135.1 R141.1 U22.10(REF) U29.19(AVSS)  [project net A_GND]
AVDD: C113.2 U28.14(OUT2+) U28.16(OUT1+) U29.20(AVDD) ; port +5V_A  [also labelled +5V_A]
DGND: C114.1 R139.1 R140.1 U22.14(DIG.GROUND) U29.11(XTAL1/CLKIN) U29.14(DGND)
DVDD: C114.2 R131.2 U29.15(DVDD) ; port +3.3V  [also labelled +3.3V]
V+: C78.2 C79.2 C115.2 R125.3(TAP) U20.8(V+) U22.13(V+) U30.3(VCC+) ; port +12v  [also labelled +12V]
V-: C76.2 C77.2 C120.2 U20.4(V-) U22.8(V-) U30.6(VCC-) ; port -12v  [also labelled -12V]
1_OUT: C81.1 R88.1 U22.11(VO) U22.12(FEEDBACK)
2_OUT: R123.2 R133.1 U20.1(OUTA) U20.2(INA-)
A0: R128.2 U22.15(A0) U28.15(OUT1-)
A1: R127.2 U22.16(A1) U28.13(OUT2-)
~{CS}: R131.1 U29.6(~{CS})
OUT-N: R130.2 R136.1 U30.4(VOUT+)
OUT-P: R137.2 R138.1 U30.5(VOUT-)
SYNCOUT: R132.1
SYNCOUT_CTR: R132.2 R134.1
VCOM: C117.2 C118.2 U29.16(REFOUT) U30.2(VOCM)
NetC80_1: C80.1 C109.2 D5.2 D6.1 R87.1 R90.2 U22.4(VIN-)
NetC81_2: C81.2 C82.1 R122.2
NetC82_2: C82.2 R89.2 U20.3(INA+)
NetC109_1: C109.1 C111.2 D5.1 D6.2 R91.2 R124.2 U22.5(VIN+)
NetC110_1: C110.1 R122.1 U20.6(INB-) U20.7(OUTB)
NetC110_2: C110.2 R88.2 R89.1
NetC112_2: C112.2 R123.1 R129.2 U20.5(INB+)
NetC116_2: C116.2 U29.13(BYPASS)
NetC119_1: C119.1 U29.18(VREFN)
NetC119_2: C119.2 U29.17(VREFP)
NetC121_1: C121.1 R138.2 U29.1(AINP)
NetC121_2: C121.2 R136.2 U29.2(AINN)
NetR90_1: R90.1 ; port IN-
NetR91_1: R91.1 ; port IN+
NetR120_1: R120.1 U28.3(IN2+)
NetR120_2: R120.2 ; port A1-CTR
NetR121_1: R121.1 U28.1(IN1+)
NetR121_2: R121.2 ; port A0-CTR
NetR125_1: R125.1(A) U22.7(VOS_ADJUST)
NetR125_2: R125.2(B) U22.6(VOS_ADJUST)
NetR126_2: R126.2 U28.2(IN1-) U28.4(IN2-)
NetR130_1: R130.1 R133.2 U30.1(VIN-)
NetR135_2: R135.2 R137.1 U30.8(VIN+)
NetR139_2: R139.2 U29.9(DOUT) ; port DOUT
NetR140_2: R140.2 R141.2 ; port GND
NetU29_3: U29.3(~{RESET}/~{PWDN}) ; port ~{RESE}T_CTR
NetU29_4: U29.4(START) ; port START_CTR
NetU29_5: U29.5(SYNCOUT) ; port SYNCOUT
NetU29_7: U29.7(SCLK) ; port SCLK
NetU29_8: U29.8(DIN) ; port DIN
NetU29_10: U29.10(~{DRDY}) ; port ~{DRD}Y_CTR

Not connected (* = marked no-connect by the designer): U22 1(VO1) 2(NC) 3(NC) 9(VO2); U28 5(IN3+) 6(IN3-) 7(IN4+) 8(IN4-) 9(OUT4-) 10(OUT4+) 11(OUT3-) 12(OUT3+); U29 12(XTAL2); U30 7(~{PD})

### Notes on the sheet
- 前置放大电路
- 前置放大控制隔离端电路
- (near U20) 50HZ陷波电路
- A/D转换电路
- 单端转双端电路
- 电源接口部分电路

### Library data of the parts
C76-C79 C81 C82 C110 C112 = Cap: Capacitor; Published: 8-Jun-2000; LatestRevisionDate: 17-Jul-2002; LatestRevisionNote: Re-released for DXP Platform.; PackageReference: RAD-0.3; Publisher: Altium Limited; PackageDescription: Radial Cap, Thru-Hole; 2 Leads; 0.3 in Pin Spacing
  C76 C78: Value: 0.1UF
  C77 C79: Value: 10UF
  C81 C82 C110: Value: 220nF
  C112: Value: 470pF
C80 C109 C111 C113-C121 = C
D5 D6 = SMBJ: TVS
R87 R90 R91 R120 R121 R124 R126-R128 R130-R141 = R
R88 R89 R122 R123 R129 = Res1: Resistor; Published: 8-Jun-2000; LatestRevisionDate: 17-Jul-2002; LatestRevisionNote: Re-released for DXP Platform.; PackageReference: AXIAL-0.3; Publisher: Altium Limited; PackageDescription: Axial Device, Thru-Hole; 2 Leads; 0.3 in Pin Spacing
  R88 R89: Value: 20.5K
  R122: Value: 5.1K
  R123: Value: 150
  R129: Value: 10K
R125 = Res Tap: Tapped Resistor; Sim Note: Enter the Resistance value and the set point into parameter fields.; Set Position: 0.5; Published: 24-Mar-1999; LatestRevisionDate: 17-Jul-2002; LatestRevisionNote: Re-released for DXP Platform.; PackageReference: VR3; Publisher: Altium Limited; PackageDescription: Variable Resistor, Thru-Hole; 3 Leads
U20 = LF442ACN: Dual Low Power JFET Input Operational Amplifier, 8-pin MDIP; Manufacturer: National Semiconductor; PackageTopMarking: NSUZXYTTE#*LF*442ACN; PowerWise: N; CompType: Amplifiers; Published: 4-Dec-2008; LatestRevisionDate: 13-Jan-2009; LatestRevisionNote: Sim Model Added.; DatasheetVersion: Aug-2000; PackageVersion: revG, May-2006; PackageReference: N08E; Publisher: Altium Limited; PackageDescription: MDIP, .365 x .250 x .130in, 8 Lead, .100in Pitch; Supplier 1: Farnell; Supplier Part Number 1: 4465726; PartNumber: LF442ACN; RoHS: N; PinCount: 8; Code_JEDEC: MS-001-BA; ComponentLink1Description: LF442 Datasheet; ComponentLink1URL: http://www.national.com/ds/LF/LF442.pdf; ComponentLink2Description: LF442 Web Page; ComponentLink2URL: http://www.national.com/pf/LF/LF442.html; ComponentLink3Description: N08E Package Page; ComponentLink3URL: http://www.national.com/packaging/folders/n08e.html
U22 = PGA204BU: Programmable Gain Instrumentation Amplifier, -40 to 85 degC, 16-pin SOIC (DW16), Green (RoHS & no Sb/Br); Manufacturer: Texas Instruments; Common Mode Input High(Min)(V): 10.5; Common Mode Input Low(Min)(V): -10.5; Gain Error (+/-)(Max)(%): 0.024; Gain(V/V): 1, 10, 100, 1000; Input Bias Current (+/-)(Max)(nA): 2; Input Offset (+/-)(Max)(uV): 50; Input Offset Drift (+/-)(Max)(uV/Degrees Celsius): 0.25; Noise at 1kHz(Typ)(nV/rt(Hz)): 13; Non-Linearity (+/-)(Max)(%): 0.001; Number of Channels: 1; Quiescent Current (+/-)(Typ)(mA): 5.2; Settling Time to 0.01%(Typ)(us): 140; Slew Rate(Typ)(V/us): 0.7; SubFamily: Programmable Gain Amplifier; Vs(Max)(V): 36; Vs(Min)(V): 9; DatasheetVersion: SBOS022; PackageVersion: 4040000-2/G, 01/2011; PackageReference: DW16; PackageDescription: 16-Pin Plastic Small Outline, Body 10.30 x 7.50 mm, Pitch 1.27 mm; Supplier 1: Digi-Key; Supplier Part Number 1: PGA204BU-ND; Supplier 2: Farnell; Supplier Part Number 2: 1207094; Supplier 3: Newark; Supplier Part Number 3: 24M5804; Supplier 4: Newark; Supplier Part Number 4: 35C1958; Supplier 5: Mouser; Supplier Part Number 5: 595-PGA204BU; Eco-Plan: Green (RoHS & no Sb/Br); Mounting Technology: Surface Mount; Code_JEDEC: MS-013; PartNumber: PGA204BU; ComponentLink1Description: Manufacturer URL; ComponentLink1URL: http://www.ti.com/; ComponentLink2Description: Datasheet; ComponentLink2URL: http://www.ti.com/general/docs/lit/getliterature.tsp?genericPartNumber=PGA204&fileType=pdf; ComponentLink3Description: Package Specification; ComponentLink3URL: http://www.ti.com/litv/pdf/msoi003g
U28 = TLP521
U29 = ADS1259BIPW: Low-Noise, 14 kSPS, 24-Bit ADC, -40 to 105 degC, 20-pin SOP (PW20), Green (RoHS & no Sb/Br); Manufacturer: Texas Instruments; # Input Channels: 1; Analog Voltage AV/DD(Max)(V): 5.25; Analog Voltage AV/DD(Min)(V): 4.75; Architecture: Delta-Sigma; Digital Supply(Min)(V): 2.7; Interface: Serial SPI; Resolution(Bits): 24; Sample Rate (max)(SPS): 14.4K; SubFamily: Precision ADC (<=10MSPS); DatasheetVersion: SBAS424D; PackageVersion: 4040064-5/G, 02/2011; PackageReference: PW20; PackageDescription: 20-Pin Plastic Small Outline, Body 6.5 x 4.4 mm, Pitch 0.65 mm; Supplier 1: Digi-Key; Supplier Part Number 1: TLC3548IPWRG4-ND; Supplier 2: Mouser; Supplier Part Number 2: 595-TLC3548IPWRG4; Digital Supply(Max)(V): 5.25; Eco-Plan: Green (RoHS & no Sb/Br); Mounting Technology: Surface Mount; Code_JEDEC: MO-153; PartNumber: ADS1259BIPW; ComponentLink1Description: Manufacturer URL; ComponentLink1URL: http://www.ti.com/; ComponentLink2Description: Datasheet; ComponentLink2URL: http://www.ti.com/general/docs/lit/getliterature.tsp?genericPartNumber=ADS1259&fileType=pdf; ComponentLink3Description: Package Specification; ComponentLink3URL: http://www.ti.com.cn/cn/lit/ml/mpds362/mpds362.pdf
U30 = THS4130ID: Fully Differential Input / Output Low Noise Amplifier with Shutdown, 5 to 30 V, -40 to 85 degC, 8-pin SOIC (D8), Green (RoHS & no Sb/Br); Manufacturer: Texas Instruments; 2nd Harmonic(dBc): 88; 3rd Harmonic(dBc): 82; @ MHz: 1; BW @ Acl(MHz): 150; Io(Typ)(mA): 85; Iq per channel(Max)(mA): 16; Offset Voltage Drift (+/-)(Max)(uV/Degrees Celsius: 4.5; Settling Time (0.1%)(Typ)(ns): 78; Slew Rate(Typ)(V/us): 52; SubFamily: Fully Differential Amplifier; THD (Fc is 1 MHz)(Typ)(dB): -80; Vio(Max)(mV): 2; Vn at Flatband(Typ)(nV/rtHz): 1.3; Vs(Max)(V): 30; Vs(Min)(V): 5; DatasheetVersion: SLOS318H; PackageVersion: 4040047-3/M, 06/2011; PackageReference: D8; PackageDescription: 8-Pin Plastic Small Outline, Body 4.9 x 3.9 mm, Pitch 1.27 mm; Supplier 1: Digi-Key; Supplier Part Number 1: 296-7554-5-ND; Supplier 2: Farnell; Supplier Part Number 2: 1103108; Supplier 3: Newark; Supplier Part Number 3: 24M8257; Supplier 4: Newark; Supplier Part Number 4: 76C6405; Supplier 5: Mouser; Supplier Part Number 5: 595-THS4130ID; Eco-Plan: Green (RoHS & no Sb/Br); Number of Channels: 1; Mounting Technology: Surface Mount; Code_JEDEC: MS-012; PartNumber: THS4130ID; ComponentLink1Description: Manufacturer URL; ComponentLink1URL: http://www.ti.com/; ComponentLink2Description: Datasheet; ComponentLink2URL: http://www.ti.com/general/docs/lit/getliterature.tsp?genericPartNumber=THS4130&fileType=pdf; ComponentLink3Description: Package Specification; ComponentLink3URL: http://www.ti.com/litv/pdf/msoi002j

## Sheet electrode 2.SchDoc
size 254 x 152 mm
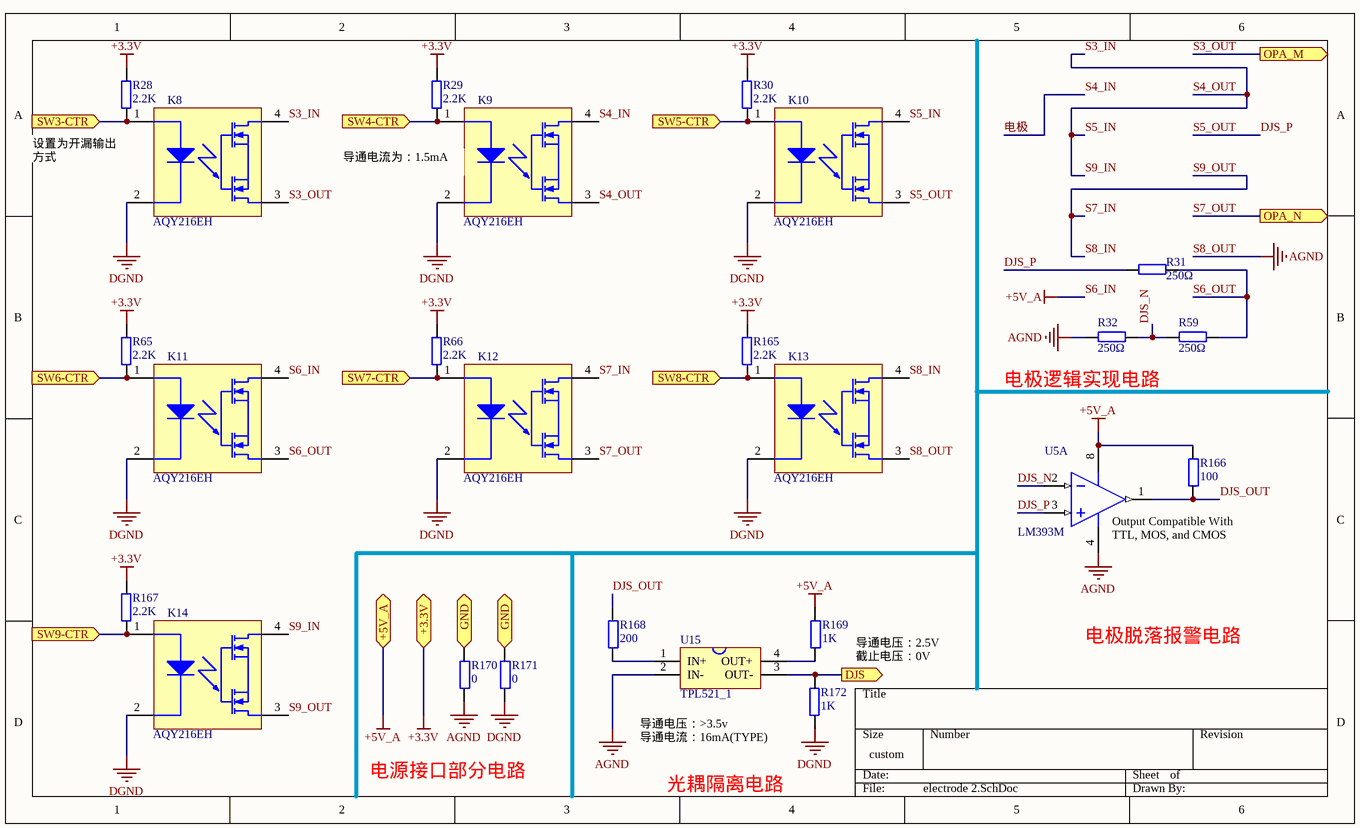
[diagram p6: electrode 2.SchDoc]

### Parts
K8  AQY216EH  [PNSC-DIP4_V]
K9  AQY216EH  [PNSC-DIP4_V]
K10  AQY216EH  [PNSC-DIP4_V]
K11  AQY216EH  [PNSC-DIP4_V]
K12  AQY216EH  [PNSC-DIP4_V]
K13  AQY216EH  [PNSC-DIP4_V]
K14  AQY216EH  [PNSC-DIP4_V]
R28  2.2K  [0603P]
R29  2.2K  [0603P]
R30  2.2K  [0603P]
R31  250Ω  [0603P]
R32  250Ω  [0603P]
R59  250Ω  [0603P]
R65  2.2K  [0603P]
R66  2.2K  [0603P]
R165  2.2K  [0603P]
R166  100  [0603P]
R167  2.2K  [0603P]
R168  200  [0603P]
R169  1K  [0603P]
R170  0  [0603P]
R171  0  [0603P]
R172  1K  [0603P]
U5  LM393M  [M08A_L]  (part A of 2)
U15  TPL521_1

### Ports
+3.3V, +5V_A, DJS (out), GND, OPA_M (out), OPA_N (out), SW3-CTR (in), SW4-CTR (in), SW5-CTR (in), SW6-CTR (in), SW7-CTR (in), SW8-CTR (in), SW9-CTR (in)

### Nets
+3.3V: R28.1 R29.1 R30.1 R65.1 R66.1 R165.1 R167.1 ; port +3.3V  [project net DVDD]
+5V_A: K11.4 R166.2 R169.2 U5.8(V+) ; port +5V_A  [also labelled S6_IN]  [project net AVDD]
AGND: K13.3 R32.2 R170.1 U5.4(GND) U15.2(IN-)  [also labelled S8_OUT]  [project net A_GND]
DGND: K8.2 K9.2 K10.2 K11.2 K12.2 K13.2 K14.2 R171.1 R172.2
DJS_N: R32.1 R59.2 U5.2(INA-)
DJS_OUT: R166.1 R168.2 U5.1(OUTA)
DJS_P: K10.3 R31.2 U5.3(INA+)  [also labelled S5_OUT]
S3_IN: K8.4 K9.3 K10.4 K14.4  [also labelled S4_OUT, S5_IN, S9_IN]
S3_OUT: K8.3 ; port OPA_M
S4_IN: K9.4  [also labelled 电极]
S6_OUT: K11.3 R31.1 R59.1
S7_IN: K12.4 K13.4 K14.3  [also labelled S8_IN, S9_OUT]
S7_OUT: K12.3 ; port OPA_N
NetK8_1: K8.1 R28.2 ; port SW3-CTR
NetK9_1: K9.1 R29.2 ; port SW4-CTR
NetK10_1: K10.1 R30.2 ; port SW5-CTR
NetK11_1: K11.1 R65.2 ; port SW6-CTR
NetK12_1: K12.1 R66.2 ; port SW7-CTR
NetK13_1: K13.1 R165.2 ; port SW8-CTR
NetK14_1: K14.1 R167.2 ; port SW9-CTR
NetR168_1: R168.1 U15.1(IN+)
NetR169_1: R169.1 U15.4(OUT+)
NetR170_2: R170.2 R171.2 ; port GND
NetR172_1: R172.1 U15.3(OUT-) ; port DJS

### Notes on the sheet
- 设置为开漏输出方式
- (near K9) 导通电流为：1.5mA
- (near R32) 电极逻辑实现电路
- (near U5) Output Compatible With TTL, MOS, and CMOS
- 电极脱落报警电路
- 导通电压：2.5V
  截止电压：0V
- 电源接口部分电路
- 导通电压：>3.5v
  导通电流：16mA(TYPE)
- 光耦隔离电路

### Library data of the parts
K8-K14 = AQY216EH: PhotoMOS GE 1 Form A, 600 V Load Voltage, 0.05 A Continuous Load Current, -40 to 85 degC, 4-Pin DIP, Tube, RoHS; Manufacturer: Panasonic; Continuous Load Current: 0.05 A; Load Voltage: 600 V; On Resistance (Typ): 52 Ohm; Pb-Free: True; DatasheetVersion: 201404-T; PackageVersion: ASCTB67E, 04/2014; PackageReference: DIP4; PackageDescription: 4-Pin Through Hole Terminal Package, Body 4.78 x 6.4 mm, Pitch 2.54 mm; Supplier 1: Mouser; Supplier Part Number 1: 769-AQY216EH; Supplier 2: Digi-Key; Supplier Part Number 2: AQY216EH-ND; Packing: Tube; RoHS: True; Series: PhotoMOS GE 1 Form A; Mounting Technology: Through Hole; PartNumber: AQY216EH; ComponentLink1Description: Manufacturer URL; ComponentLink1URL: http://www3.panasonic.biz/ac/ae/index.jsp; ComponentLink2Description: Datasheet; ComponentLink2URL: http://www3.panasonic.biz/ac/e_download/control/relay/photomos/catalog/semi_eng_ge1a_aqy21_e.pdf; ComponentLink3Description: Package Specification; ComponentLink3URL: http://www3.panasonic.biz/ac/e_download/control/relay/photomos/catalog/semi_eng_dimensions.pdf?f_cd=401560
R28-R32 R59 R65 R66 R165-R172 = R
U5 = LM393M: Low Power Low Offset Voltage Dual Comparator, 8-pin Narrow SOIC; Manufacturer: National Semiconductor; PackageTopMarking: NSZXTT*LM*393M; PowerWise: N; CompType: Amplifiers; High-Reliability: Y; DatasheetVersion: Aug-2002; PackageVersion: revM, May-2009; PackageReference: M08A; PackageDescription: SOIC Narrow, 4.9 x 3.9 x 1.45mm, 8 Lead, 1.27mm Pitch; PartNumber: LM393M; RoHS: N; PinCount: 8; Code_JEDEC: MS-012-AA; Code_IPC: SOIC127P600-8; ComponentLink1Description: Manufacturer URL; ComponentLink1URL: http://www.national.com/; ComponentLink2Description: LM393 Datasheet; ComponentLink2URL: http://www.national.com/ds/LM/LM393.pdf; ComponentLink3Description: LM393 Web Page; ComponentLink3URL: http://www.national.com/pf/LM/LM393.html; ComponentLink4Description: M08A Package Page; ComponentLink4URL: http://www.national.com/packaging/folders/m08a.html

## Nets that join several sheets
+3.3V: MCU (28 pins), AD (9 pins), Power (5 pins), GPS (8 pins)
+5V_A: AD (6 pins), Power (5 pins)
A_GND: AD (12 pins), Power (12 pins), Preamplifier_2 (24 pins), electrode 2 (5 pins)
AVDD: Preamplifier_2 (C113.2 U28.14 U28.16 U29.20), electrode 2 (K11.4 R166.2 R169.2 U5.8)
DGND: MCU (42 pins), AD (C39.2 R149.1), Power (9 pins), GPS (24 pins), Preamplifier_2 (6 pins), electrode 2 (9 pins)
DVDD: Preamplifier_2 (C114.2 R131.2 U29.15), electrode 2 (7 pins)
FILTER: MCU (U36.25), AD (R16.1 U34.14)
GAIN: MCU (U36.24), AD (R21.1 U34.4)
NetR26_2: MCU (R154.1), AD (R26.2 R149.2), Power (R155.2 R156.2 R157.2)
PDRST: MCU (U36.26), AD (R20.1 U34.13)
SCLK: MCU (U36.21), AD (R17.1 U34.1)